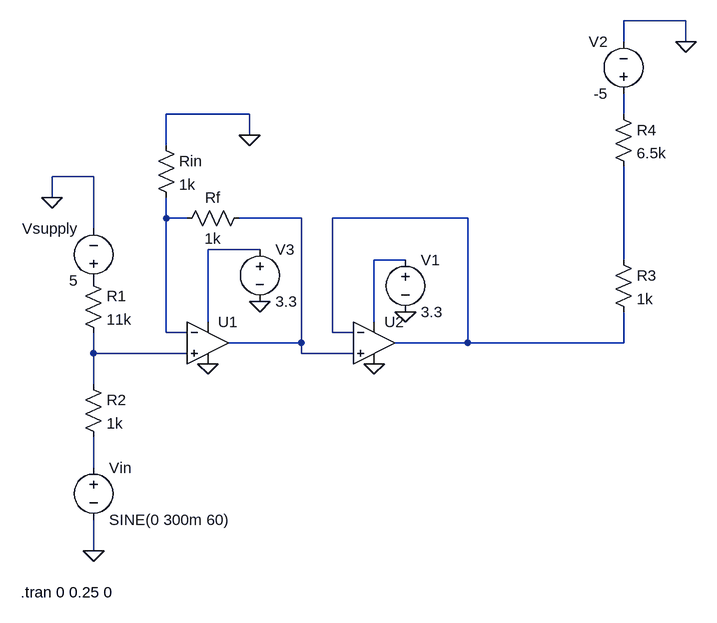
[diagram p0: schematic voltage_offset_preamp.asc]
voltage_offset_preamp.asc, the LTspice schematic file:
Version 4
SHEET 1 1076 680
WIRE 1056 -304 960 -304
WIRE 960 -272 960 -304
WIRE 1056 -272 1056 -304
WIRE 384 -160 256 -160
WIRE 960 -160 960 -192
WIRE 384 -128 384 -160
WIRE 256 -112 256 -160
WIRE 144 -64 80 -64
WIRE 80 -32 80 -64
WIRE 256 0 256 -32
WIRE 288 0 256 0
WIRE 464 0 368 0
WIRE 720 0 512 0
WIRE 144 16 144 -64
WIRE 400 48 320 48
WIRE 624 64 576 64
WIRE 960 64 960 -80
WIRE 320 160 320 48
WIRE 576 160 576 64
WIRE 256 176 256 0
WIRE 288 176 256 176
WIRE 512 176 512 0
WIRE 544 176 512 176
WIRE 464 192 464 0
WIRE 464 192 352 192
WIRE 720 192 720 0
WIRE 720 192 608 192
WIRE 960 192 960 144
WIRE 960 192 720 192
WIRE 144 208 144 176
WIRE 288 208 144 208
WIRE 464 208 464 192
WIRE 544 208 464 208
WIRE 144 256 144 208
WIRE 144 384 144 336
WIRE 144 512 144 464
FLAG 144 512 0
FLAG 80 -32 0
FLAG 384 -128 0
FLAG 400 128 0
FLAG 320 224 0
FLAG 576 224 0
FLAG 624 144 0
FLAG 1056 -272 0
SYMBOL voltage 144 112 R180
WINDOW 0 24 96 Left 2
WINDOW 3 24 16 Left 2
WINDOW 123 0 0 Left 0
WINDOW 39 0 0 Left 0
SYMATTR InstName Vsupply
SYMATTR Value 5
SYMBOL res 128 80 R0
SYMATTR InstName R1
SYMATTR Value 11k
SYMBOL res 128 240 R0
SYMATTR InstName R2
SYMATTR Value 1k
SYMBOL voltage 144 368 R0
WINDOW 123 0 0 Left 0
WINDOW 39 0 0 Left 0
SYMATTR InstName Vin
SYMATTR Value SINE(0 300m 60)
SYMBOL OpAmps\\UniversalOpAmp 320 192 R0
SYMATTR InstName U1
SYMBOL res 240 -128 R0
SYMATTR InstName Rin
SYMATTR Value 1k
SYMBOL res 384 -16 R90
WINDOW 0 0 56 VBottom 2
WINDOW 3 32 56 VTop 2
SYMATTR InstName Rf
SYMATTR Value 1k
SYMBOL voltage 400 32 R0
WINDOW 123 0 0 Left 0
WINDOW 39 0 0 Left 0
SYMATTR InstName V3
SYMATTR Value 3.3
SYMBOL OpAmps\\UniversalOpAmp 576 192 R0
SYMATTR InstName U2
SYMBOL voltage 624 48 R0
WINDOW 123 0 0 Left 0
WINDOW 39 0 0 Left 0
SYMATTR InstName V1
SYMATTR Value 3.3
SYMBOL res 944 48 R0
SYMATTR InstName R3
SYMATTR Value 1k
SYMBOL res 944 -176 R0
SYMATTR InstName R4
SYMATTR Value 6.5k
SYMBOL voltage 960 -176 R180
WINDOW 0 24 96 Left 2
WINDOW 3 24 16 Left 2
SYMATTR InstName V2
SYMATTR Value -5
TEXT 32 576 Left 2 !.tran 0 0.25 0

The netlist it stands for:
* voltage_offset_preamp.asc
Vsupply P001 0 5
R1 P001 N008 11k
R2 N008 N009 1k
Vin N009 0 SINE(0 300m 60)
XU1 N008 N002 N005 0 N003 level1 Avol=1Meg GBW=10Meg Vos=0 En=0 Enk=0 In=0 Ink=0 Rin=500Meg  ; pins In+ In- V+ V- OUT
Rin 0 N002 1k
Rf N003 N002 1k
V3 N005 0 3.3
XU2 N003 N004 N006 0 N004 level1 Avol=1Meg GBW=10Meg Vos=0 En=0 Enk=0 In=0 Ink=0 Rin=500Meg  ; pins In+ In- V+ V- OUT
V1 N006 0 3.3
R3 N007 N004 1k
R4 N001 N007 6.5k
V2 N001 0 -5
.tran 0 0.25 0
.lib UniversalOpAmp1.lib
.backanno
.end